# EasyEDA schematic 1-Schematic_ESP8266.json
TITLE: Smart Tag; REV: 1.0; Date: 2023-01-20; Sheet: 1/1; Drawn By: samarth_58; Company: -
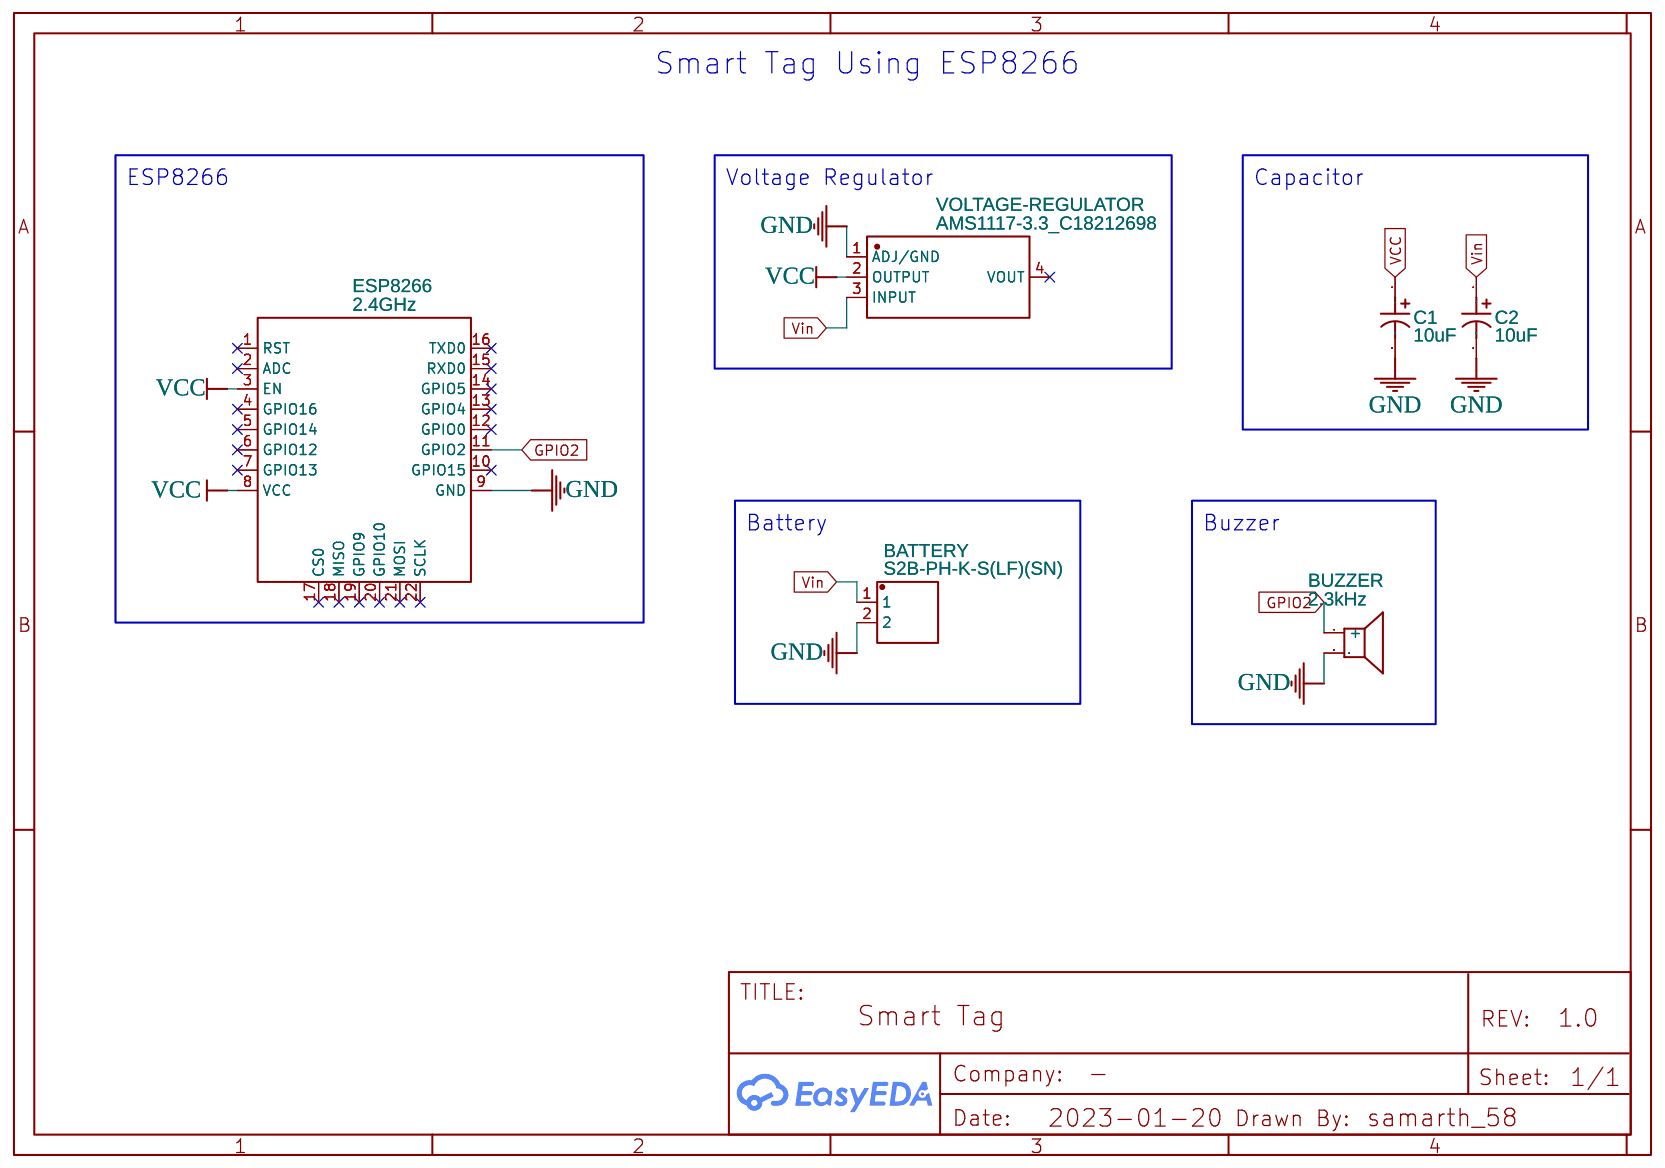
[diagram p0: schematic sheet]

## Parts
BATTERY  S2B-PH-K-S(LF)(SN)  [CONN-TH_S2B-PH-K-S-LF-SN]
BUZZER  2.3kHz  [BUZ-TH_BD12.0-P7.60-D0.6-FD]
C1  10uF  [CAP-SMD_BD4.0-L4.3-W4.3-FD]
C2  10uF  [CAP-SMD_BD4.0-L4.3-W4.3-FD]
ESP8266  2.4GHz  [WIFIM-SMD_ESP-12F-ESP8266MOD]
VOLTAGE-REGULATOR  AMS1117-3.3_C18212698  [SOT-223-3_L6.5-W3.4-P2.30-LS7.0-BR]

## Library data of the parts
BATTERY = S2B-PH-K-S(LF)(SN): Contributor: LCSC; Supplier: LCSC; Supplier Part: C173752; Manufacturer: JST; JLCPCB Part Class: Extended Part
BUZZER = TMB12A05: Supplier: LCSC; Manufacturer: 华能; Supplier Part: C96093; JLCPCB Part Class: Extended Part
C1 C2 = RST10UF16V013: Supplier: LCSC; Supplier Part: C4747968; Manufacturer: KNSCHA(科尼盛); JLCPCB Part Class: Extended Part; Contributor: lcsc
ESP8266 = ESP-12F(ESP8266MOD): Supplier: LCSC; Manufacturer: Ai-Thinker(安信可); Supplier Part: C82891; JLCPCB Part Class: Extended Part
VOLTAGE-REGULATOR = AMS1117-3.3_C18212698: Supplier: LCSC; Supplier Part: C18212698; Manufacturer: TECH PUBLIC(台舟); Manufacturer Part: AMS1117-3.3; Contributor: lcsc; JLCPCB Part Class: Extended Part

## Nets
GND: BATTERY.2 BUZZER.2 C1.2 C2.2 ESP8266.9(GND) VOLTAGE-REGULATOR.1(ADJ/GND)
VCC: C1.1 ESP8266.3(EN) ESP8266.8(VCC) VOLTAGE-REGULATOR.2(OUTPUT)
Vin: BATTERY.1 C2.1 VOLTAGE-REGULATOR.3(INPUT)
GPIO2: BUZZER.1(+) ESP8266.11(GPIO2)

Not connected (* = marked no-connect by the designer): ESP8266 1(RST)* 2(ADC)* 4(GPIO16)* 5(GPIO14)* 6(GPIO12)* 7(GPIO13)* 10(GPIO15)* 12(GPIO0)* 13(GPIO4)* 14(GPIO5)* 15(RXD0)* 16(TXD0)* 17(CS0)* 18(MISO)* 19(GPIO9)* 20(GPIO10)* 21(MOSI)* 22(SCLK)*; VOLTAGE-REGULATOR 4(VOUT)*

## Notes on the sheet
- Smart Tag Using ESP8266
- ESP8266
- Voltage Regulator
- Capacitor
- Battery
- Buzzer
